# Altium project OPA_Loop.PrjPcb
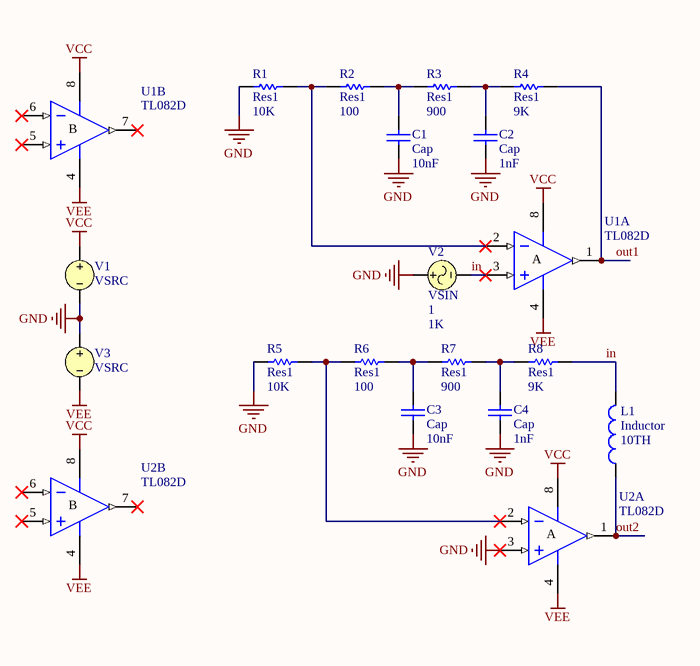
[diagram p0: OPA_Loop.SchDoc]
1 sheet, 18 parts. Net scope: global (net labels, ports and power ports of the same name join across sheets).

## Sheet OPA_Loop.SchDoc
size A4

### Parts
C1  Cap  value 10nF  [RAD-0.3]
C2  Cap  value 1nF  [RAD-0.3]
C3  Cap  value 10nF  [RAD-0.3]
C4  Cap  value 1nF  [RAD-0.3]
L1  Inductor  value 10TH  [0402-A]
R1  Res1  value 10K  [AXIAL-0.3]
R2  Res1  value 100  [AXIAL-0.3]
R3  Res1  value 900  [AXIAL-0.3]
R4  Res1  value 9K  [AXIAL-0.3]
R5  Res1  value 10K  [AXIAL-0.3]
R6  Res1  value 100  [AXIAL-0.3]
R7  Res1  value 900  [AXIAL-0.3]
R8  Res1  value 9K  [AXIAL-0.3]
U1  TL082D  [D008_L]  (parts A,B of 2)
U2  TL082D  [D008_L]  (parts A,B of 2)
V1  VSRC
V2  VSIN  AC Magnitude: 1  Frequency: 1K
V3  VSRC

### Nets
GND: C1.1 C2.1 C3.1 C4.1 R1.1 R5.1 U2.3(IN+) V1.2 V2.1 V3.1
VCC: U1.8(V+) U2.8(V+) V1.1
VEE: U1.4(V-) U2.4(V-) V3.2
in: L1.2 R8.2 U1.3(IN+) V2.2
out1: R4.2 U1.1(OUT)
out2: L1.1 U2.1(OUT)
NetC1_2: C1.2 R2.2 R3.1
NetC2_2: C2.2 R3.2 R4.1
NetC3_2: C3.2 R6.2 R7.1
NetC4_2: C4.2 R7.2 R8.1
NetR1_2: R1.2 R2.1 U1.2(IN-)
NetR5_2: R5.2 R6.1 U2.2(IN-)

Not connected (* = marked no-connect by the designer): U1 5(IN+)* 6(IN-)* 7(OUT)*; U2 5(IN+)* 6(IN-)* 7(OUT)*

### Notes on the sheet
- (in symbol TL082D, part A) A
- (in symbol TL082D, part B) B

### Library data of the parts
C1-C4 = Cap: Capacitor; Published: 8-Jun-2000; LatestRevisionDate: 17-Jul-2002; LatestRevisionNote: Re-released for DXP Platform.; PackageReference: RAD-0.3; Publisher: Altium Limited; PackageDescription: Radial Cap, Thru-Hole; 2 Leads; 0.3 in Pin Spacing
L1 = Inductor: Code_IEC: 1005; Published: 8-Jun-2000; LatestRevisionDate: 29-May-2009; LatestRevisionNote: IPC-7351 Footprint Added.; PackageReference: 0402-A; Publisher: Altium Limited; PackageDescription: Chip Inductor; Code_JEITA: 0402
R1-R8 = Res1: Resistor; Published: 8-Jun-2000; LatestRevisionDate: 17-Jul-2002; LatestRevisionNote: Re-released for DXP Platform.; PackageReference: AXIAL-0.3; Publisher: Altium Limited; PackageDescription: Axial Device, Thru-Hole; 2 Leads; 0.3 in Pin Spacing
U1 U2 = TL082D: JFET-Input Operational Amplifier; Published: 16-Jan-2001; LatestRevisionDate: 13-Apr-2006; LatestRevisionNote: IPC-7351 Footprint Added.; DatasheetVersion: Feb-1999; PackageVersion: Jan-1998; PackageReference: D008; Publisher: Altium Limited; PackageDescription: 8-Pin Small Outline Integrated Circuit 1.27 mm Pitch; Code_IPC: SOIC127P600-8; ComponentLink1Description: Manufacturer Link; ComponentLink1URL: http://www.ti.com/; ComponentLink2Description: Datasheet; ComponentLink2URL: http://www-s.ti.com/sc/ds/tl082.pdf
V1 V3 = VSRC: Voltage Source; Note: PCB Footprint - Not required; Value: 15V; Published: 8-Jun-2000; LatestRevisionDate: 17-Jul-2002; LatestRevisionNote: Re-released for DXP Platform.; PackageReference: Not Applicable; Publisher: Altium Limited
V2 = VSIN: Sinusoidal Voltage Source; Note: PCB Footprint - Not required; Published: 8-Jun-2000; LatestRevisionDate: 15-Nov-2004; LatestRevisionNote: Corrected Netlist.; PackageReference: Not Applicable; Publisher: Altium Limited